# Altium schematic sheet LPCB278 - 1 WIRE.SchDoc
size A3; Address1: Factory 10; Address2: 9-13 Dingley Avenue, Dandeong, VICTORIA 3175, AUSTRALIA; DocumentNumber: 2; Revision: 1; SheetNumber: 2; SheetTotal: 5; Lockie__PCB_SUB_ASSEMBLY: PCB Sub Component; Lockie__PCB_ASSEMBLY: PCB Assembly; Lockie__LDL: LPCB278; Lockie__PCB_DESCRIPTION: HE Thermal Module
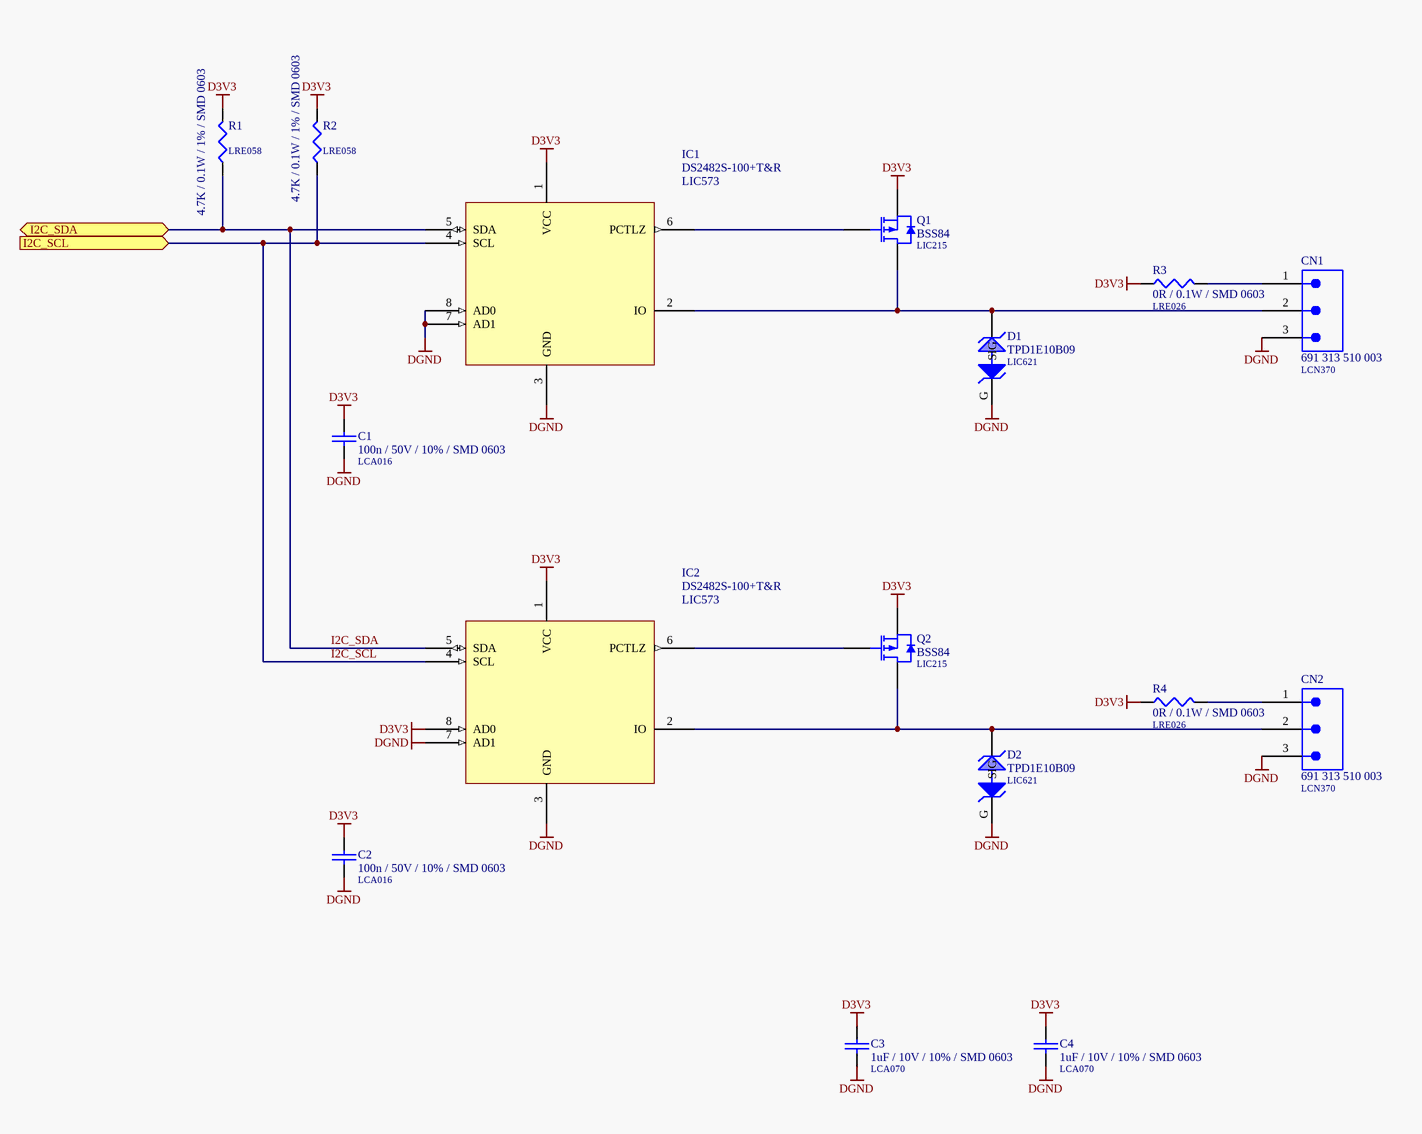
[diagram p0: LPCB278 - 1 WIRE.SchDoc]

## Parts
C1  100n / 50V / 10% / SMD 0603  LDL_NUMBER: LCA016  [LFP011__CC1608-0603-IPC7351_B]
C2  100n / 50V / 10% / SMD 0603  LDL_NUMBER: LCA016  [LFP011__CC1608-0603-IPC7351_B]
C3  1uF / 10V / 10% / SMD 0603  LDL_NUMBER: LCA070  [LFP011__CC1608-0603-IPC7351_B]
C4  1uF / 10V / 10% / SMD 0603  LDL_NUMBER: LCA070  [LFP011__CC1608-0603-IPC7351_B]
CN1  691 313 510 003  LDL_NUMBER: LCN370  [691 313 510 003]
CN2  691 313 510 003  LDL_NUMBER: LCN370  [691 313 510 003]
D1  TPD1E10B09  LDL_NUMBER: LIC621  [LFP157__R-PX1SON-N2]
D2  TPD1E10B09  LDL_NUMBER: LIC621  [LFP157__R-PX1SON-N2]
IC1  DS2482S-100+T&R  LDL_NUMBER: LIC573  [LFP069__R-8G]
IC2  DS2482S-100+T&R  LDL_NUMBER: LIC573  [LFP069__R-8G]
Q1  BSS84  LDL_NUMBER: LIC215  [LFP021__SOT23]
Q2  BSS84  LDL_NUMBER: LIC215  [LFP021__SOT23]
R1  4.7K / 0.1W / 1% / SMD 0603  LDL_NUMBER: LRE058  [LFP020__CR1608-0603-IPC7351_B]
R2  4.7K / 0.1W / 1% / SMD 0603  LDL_NUMBER: LRE058  [LFP020__CR1608-0603-IPC7351_B]
R3  0R / 0.1W / SMD 0603  LDL_NUMBER: LRE026  [LFP020__CR1608-0603-IPC7351_B]
R4  0R / 0.1W / SMD 0603  LDL_NUMBER: LRE026  [LFP020__CR1608-0603-IPC7351_B]

## Ports
I2C_SCL (in), I2C_SDA (bidir)

## Nets
D3V3: C1.1 C2.1 C3.1 C4.1 IC1.1(VCC) IC2.1(VCC) IC2.8(AD0) Q1.2(S) Q2.2(S) R1.2 R2.2 R3.1 R4.1
DGND: C1.2 C2.2 C3.2 C4.2 CN1.3 CN2.3 D1.G D2.G IC1.3(GND) IC1.7(AD1) IC1.8(AD0) IC2.3(GND) IC2.7(AD1)
I2C_SCL: IC1.4(SCL) IC2.4(SCL) R2.1 ; port I2C_SCL
I2C_SDA: IC1.5(SDA) IC2.5(SDA) R1.1 ; port I2C_SDA
NetCN1_1: CN1.1 R3.2
NetCN1_2: CN1.2 D1.2(SIG) IC1.2(IO) Q1.3(D)
NetCN2_1: CN2.1 R4.2
NetCN2_2: CN2.2 D2.2(SIG) IC2.2(IO) Q2.3(D)
NetIC1_6: IC1.6(PCTLZ) Q1.1(G)
NetIC2_6: IC2.6(PCTLZ) Q2.1(G)

## Notes on the sheet
- PCB COMPONENT DESCRIPTION
- LDL NUMBER
- Assembly Details
- Size
- Drawing File Name
- Revision
- http://rloop.org
- Scale
- A3
- Sheet Details
- N.T.S
- Sheet:
- Of:

## Library data of the parts
C1 C2 = 100n / 50V / 10% / SMD 0603: Capacitor, Ceramic Chip, 100nF (0.1uF), 50V, 5%, SMD 0603 [LCA016]; FMEDA__OPERATING__VOLTAGE_MIN: 0; FMEDA__OPERATING__VOLTAGE_MAX: 3.3; FMEDA__OPERATING__TEMP_MIN: -20; FMEDA__OPERATING__TEMP_TYP: 27; FMEDA__OPERATING__TEMP_MAX: 50; FMEDA__CHANNEL: COM; Value: 100n; FMEDA__FUNCTION_IN_SYSTEM: *; FMEDA__OPERATING__VOLTAGE_TYP: 3.3
C3 C4 = 1uF / 10V / 10% / SMD 0603: Capacitor, Ceramic Chip, 1uF, 10V, SMD 0603 [LCA070]; Value: 1u; FMEDA__OPERATING__VOLTAGE_MAX: 3.3; FMEDA__OPERATING__VOLTAGE_MIN: 0; FMEDA__OPERATING__TEMP_MAX: 50; FMEDA__OPERATING__TEMP_MIN: -20; FMEDA__OPERATING__TEMP_TYP: 27; FMEDA__CHANNEL: COM; FMEDA__OPERATING__VOLTAGE_TYP: 3.3; FMEDA__FUNCTION_IN_SYSTEM: *
CN1 CN2 = 691 313 510 003: Connector, Pluggable Terminal Block, 5.08mm, 3 Way, PTH; FMEDA__CHANNEL: COM; FMEDA__OPERATING__CURRENT_MAX: 0; FMEDA__OPERATING__TEMP_MAX: 50; FMEDA__OPERATING__TEMP_MIN: -20; FMEDA__OPERATING__TEMP_TYP: 27; FMEDA__OPERATING__VOLTAGE_MAX: 16; FMEDA__OPERATING__VOLTAGE_TYP: 12; FMEDA__FUNCTION_IN_SYSTEM: *; FMEDA__OPERATING__CURRENT_MIN: 0; FMEDA__OPERATING__CURRENT_TYP: 0; FMEDA__OPERATING__VOLTAGE_MIN: 0
D1 D2 = TPD1E10B09: Diode, ESD Protecion, 10pF, 9V Breakdown, SMD 0402 [LIC621]; FMEDA__OPERATING__TEMP_MAX: 50; FMEDA__OPERATING__TEMP_MIN: -20; FMEDA__OPERATING__TEMP_TYP: 27; FMEDA__OPERATING__VOLTAGE_MAX: 0; FMEDA__CHANNEL: COM; FMEDA__FUNCTION_IN_SYSTEM: *; FMEDA__OPERATING__VOLTAGE_MIN: 0; FMEDA__OPERATING__VOLTAGE_TYP: 0; FMEDA__OPERATING__CURRENT_MAX: 0; FMEDA__OPERATING__CURRENT_MIN: 0; FMEDA__OPERATING__CURRENT_TYP: 0
IC1 IC2 = DS2482S-100+T&R: IC, I2C to 1 Wire Bridge, SMD SOIC8
Q1 Q2 = BSS84: FET, P Channel, Logic Level, SMD SOT23 [LIC215]; FMEDA__OPERATING__TEMP_MAX: 50; FMEDA__OPERATING__TEMP_MIN: -20; FMEDA__OPERATING__TEMP_TYP: 27; FMEDA__CHANNEL: COM
R1 R2 = 4.7K / 0.1W / 1% / SMD 0603: Resistor, Ceramic Chip, 4K7, 0.1W, 1%, SMD 0603 [LRE058]; FMEDA__OPERATING__POWER_MAX: 0; FMEDA__OPERATING__TEMP_MAX: 50; FMEDA__OPERATING__TEMP_MIN: -20; FMEDA__OPERATING__TEMP_TYP: 27; FMEDA__CHANNEL: COM; VALUE: 4.7K; FMEDA__OPERATING__POWER_MIN: 0; FMEDA__OPERATING__VOLTAGE_MAX: 0; FMEDA__OPERATING__VOLTAGE_MIN: 0; FMEDA__OPERATING__VOLTAGE_TYP: 0; FMEDA__FUNCTION_IN_SYSTEM: *
R3 R4 = 0R / 0.1W / SMD 0603: Resistor, Ceramic Chip, 0R, 0.1W, SMD 0603 [LRE026]; Value: 0; FMEDA__OPERATING__TEMP_MAX: 50; FMEDA__OPERATING__TEMP_MIN: -20; FMEDA__OPERATING__TEMP_TYP: 27; FMEDA__CHANNEL: COM; FMEDA__OPERATING__POWER_MAX: 0; FMEDA__OPERATING__POWER_MIN: 0; FMEDA__OPERATING__VOLTAGE_MAX: 0; FMEDA__OPERATING__VOLTAGE_MIN: 0; FMEDA__OPERATING__VOLTAGE_TYP: 0; FMEDA__FUNCTION_IN_SYSTEM: *